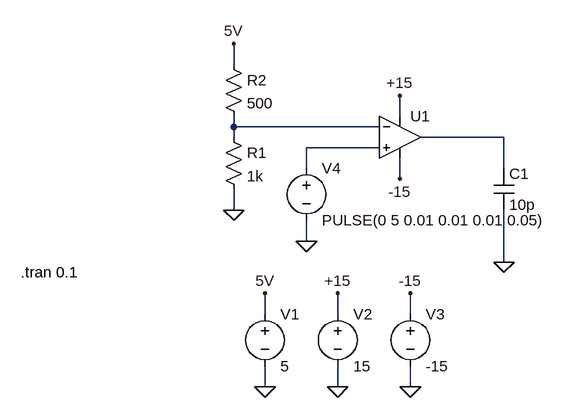
[diagram p0: schematic Draft2.asc]
Draft2.asc, the LTspice schematic file:
Version 4
SHEET 1 880 680
WIRE -144 -112 -144 -144
WIRE 112 -32 112 -64
WIRE -144 -16 -144 -32
WIRE 80 -16 -144 -16
WIRE -144 0 -144 -16
WIRE 272 0 144 0
WIRE 80 16 -32 16
WIRE -32 48 -32 16
WIRE 272 48 272 0
WIRE 112 64 112 32
WIRE -144 112 -144 80
WIRE -32 160 -32 128
WIRE 272 192 272 112
WIRE -96 272 -96 240
WIRE 16 272 16 240
WIRE 128 272 128 240
WIRE -96 384 -96 352
WIRE 16 384 16 352
WIRE 128 384 128 352
FLAG -96 384 0
FLAG 16 384 0
FLAG 128 384 0
FLAG -96 240 5V
FLAG -144 -144 5V
FLAG -144 112 0
FLAG -32 160 0
FLAG 16 240 +15
FLAG 112 -64 +15
FLAG 128 240 -15
FLAG 112 64 -15
FLAG 272 192 0
SYMBOL voltage -96 256 R0
WINDOW 123 0 0 Left 0
WINDOW 39 0 0 Left 0
SYMATTR InstName V1
SYMATTR Value 5
SYMBOL voltage 16 256 R0
WINDOW 123 0 0 Left 0
WINDOW 39 0 0 Left 0
SYMATTR InstName V2
SYMATTR Value 15
SYMBOL voltage 128 256 R0
WINDOW 123 0 0 Left 0
WINDOW 39 0 0 Left 0
SYMATTR InstName V3
SYMATTR Value -15
SYMBOL voltage -32 32 R0
WINDOW 123 0 0 Left 0
WINDOW 39 0 0 Left 0
SYMATTR InstName V4
SYMATTR Value PULSE(0 5 0.01 0.01 0.01 0.05)
SYMBOL res -160 -16 R0
SYMATTR InstName R1
SYMATTR Value 1k
SYMBOL res -160 -128 R0
SYMATTR InstName R2
SYMATTR Value 500
SYMBOL cap 256 48 R0
SYMATTR InstName C1
SYMATTR Value 10p
SYMBOL OpAmps\\UniversalOpAmp2 112 0 R0
SYMATTR InstName U1
TEXT -472 208 Left 2 !.tran 0.1

The netlist it stands for:
* Draft2.asc
V1 5V 0 5
V2 +15 0 15
V3 -15 0 -15
V4 N003 0 PULSE(0 5 0.01 0.01 0.01 0.05)
R1 N001 0 1k
R2 5V N001 500
C1 N002 0 10p
XU1 N003 N001 +15 -15 N002 level2 Avol=1Meg GBW=10Meg Slew=10Meg Ilimit=25m Rail=0 Vos=0 En=0 Enk=0 In=0 Ink=0 Rin=500Meg  ; pins In+ In- V+ V- OUT
.tran 0.1
.lib UniversalOpAmp2.lib
.backanno
.end